# EAGLE schematic Main Board (EAGLE 9.3.2)
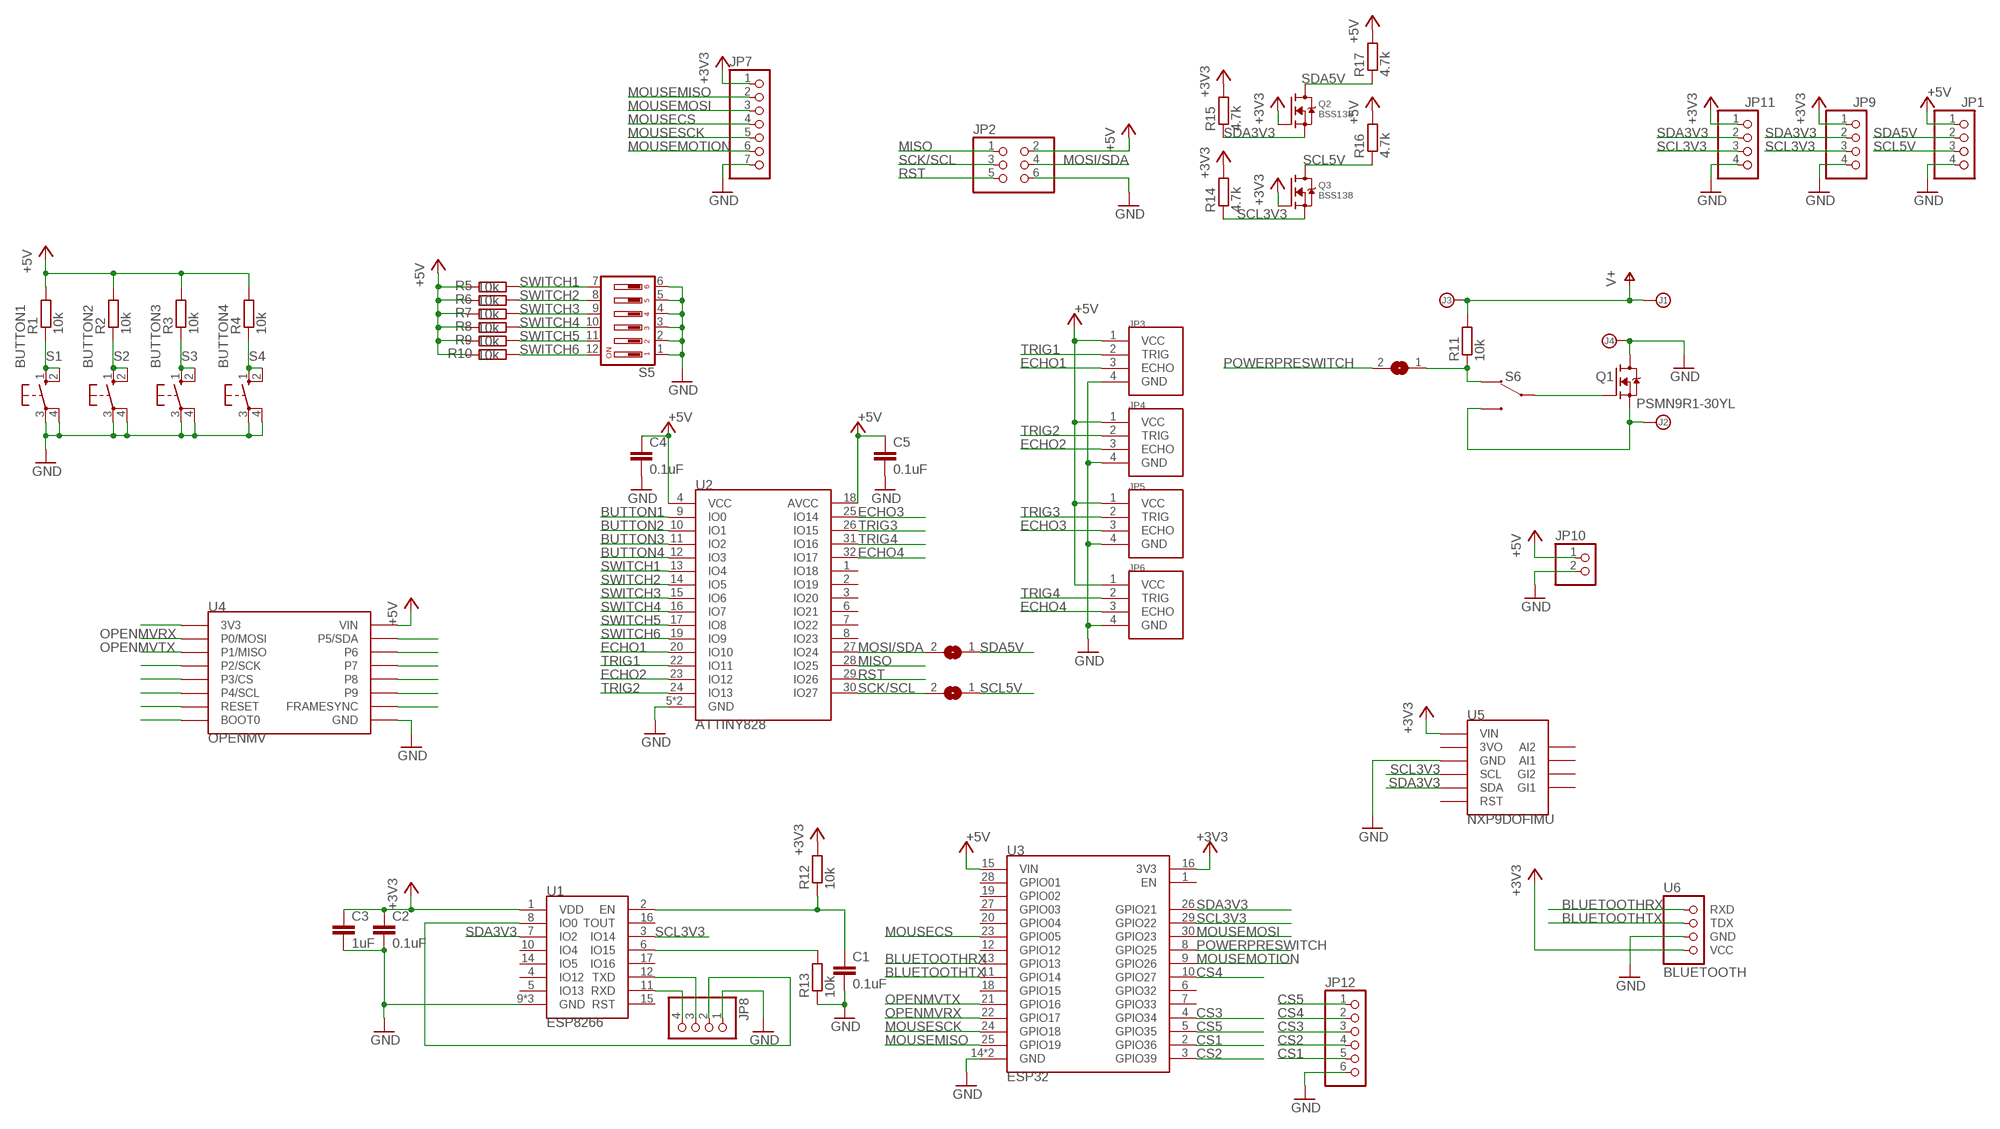
[diagram p0: schematic, sheet 1]

## Parts
C1  0.1uF  C-EUC0805  [C0805]
C2  0.1uF  C-EUC0805  [C0805]
C3  1uF  C-EUC0805  [C0805]
C4  0.1uF  C-EUC0805  [C0805]
C5  0.1uF  C-EUC0805  [C0805]
J1  MOLEXQUICKCONNECT  [MOLEXQUICKCONNECT]
J2  MOLEXQUICKCONNECT  [MOLEXQUICKCONNECT]
J3  MOLEXQUICKCONNECT  [MOLEXQUICKCONNECT]
J4  MOLEXQUICKCONNECT  [MOLEXQUICKCONNECT]
JP1  PINHD-1X4  [1X04]
JP2  PINHD-2X3  [2X03]
JP3  HC-SR04  [HC-SR04]
JP4  HC-SR04  [HC-SR04]
JP5  HC-SR04  [HC-SR04]
JP6  HC-SR04  [HC-SR04]
JP7  PINHD-1X7  [1X07]
JP8  PINHD-1X4  [1X04]
JP9  PINHD-1X4  [1X04]
JP10  PINHD-1X2  [1X02]
JP11  PINHD-1X4  [1X04]
JP12  PINHD-1X6  [1X06]
Q1  PSMN9R1-30YL  [LFPAK]
Q2  BSS138  [SOT95P240X120-3N]
Q3  BSS138  [SOT95P240X120-3N]
R1  10k  R-EU_R0805  [R0805]
R2  10k  R-EU_R0805  [R0805]
R3  10k  R-EU_R0805  [R0805]
R4  10k  R-EU_R0805  [R0805]
R5  10k  R-EU_R0805  [R0805]
R6  10k  R-EU_R0805  [R0805]
R7  10k  R-EU_R0805  [R0805]
R8  10k  R-EU_R0805  [R0805]
R9  10k  R-EU_R0805  [R0805]
R10  10k  R-EU_R0805  [R0805]
R11  10k  R-EU_R0805  [R0805]
R12  10k  R-EU_R0805  [R0805]
R13  10k  R-EU_R0805  [R0805]
R14  4.7k  R-EU_R0805  [R0805]
R15  4.7k  R-EU_R0805  [R0805]
R16  4.7k  R-EU_R0805  [R0805]
R17  4.7k  R-EU_R0805  [R0805]
S1  BUTTON  [BUTTON]
S2  BUTTON  [BUTTON]
S3  BUTTON  [BUTTON]
S4  BUTTON  [BUTTON]
S5  SWITCHARRAY6  [SWITCHARRAY6]
S6  SS-12D07-VG  [SS-12D07-VG]
SJ1  SJ  [SJ]
SJ2  SJ  [SJ]
SJ3  SJ  [SJ]
U1  ESP8266  [ESP8266]
U2  ATTINY828  [QFP80P900X900X120-32]
U3  ESP32  [ESP32]
U4  OPENMV  [OPENMV]
U5  NXP9DOFIMU  [NXP9DOFIMU]
U6  BLUETOOTH  [BLUETOOTH]

## Nets
+3V3: C2.1 C3.1 JP7.1 JP9.1 JP11.1 Q2.1(G) Q3.1(G) R12.2 R14.2 R15.2 U1.1(VDD) U3.16(3V3) U5.VIN U6.VCC
+5V: C4.1 C5.1 JP1.1 JP2.2 JP3.1(VCC) JP4.1(VCC) JP5.1(VCC) JP6.1(VCC) JP10.1 R1.2 R2.2 R3.2 R4.2 R5.2 R6.2 R7.2 R8.2 R9.2 R10.2 R16.2 R17.2 U2.4(VCC) U2.18(AVCC) U3.15(VIN) U4.15(VIN) U4.15ALT(VIN) U4.P$15(VIN)
BLUETOOTHRX: U3.13(GPIO13) U6.RXD
BLUETOOTHTX: U3.11(GPIO14) U6.TXD(TDX)
BUTTON1: R1.1 S1.1(S) S1.2(S1) U2.9(IO0)
BUTTON2: R2.1 S2.1(S) S2.2(S1) U2.10(IO1)
BUTTON3: R3.1 S3.1(S) S3.2(S1) U2.11(IO2)
BUTTON4: R4.1 S4.1(S) S4.2(S1) U2.12(IO3)
CS1: JP12.5 U3.2(GPIO36)
CS2: JP12.4 U3.3(GPIO39)
CS3: JP12.3 U3.4(GPIO34)
CS4: JP12.2 U3.10(GPIO27)
CS5: JP12.1 U3.5(GPIO35)
ECHO1: JP3.3(ECHO) U2.20(IO10)
ECHO2: JP4.3(ECHO) U2.23(IO12)
ECHO3: JP5.3(ECHO) U2.25(IO14)
ECHO4: JP6.3(ECHO) U2.32(IO17)
GND: C1.2 C2.2 C3.2 C4.2 C5.2 J4.P$1 J4.P$3 J4.P$4 JP1.4 JP2.6 JP3.4(GND) JP4.4(GND) JP5.4(GND) JP6.4(GND) JP7.7 JP8.1 JP9.4 JP10.2 JP11.4 JP12.6 Q1.TAB(D) R13.1 S1.3(P) S1.4(P1) S2.3(P) S2.4(P1) S3.3(P) S3.4(P1) S4.3(P) S4.4(P1) S5.1 S5.2 S5.3 S5.4 S5.5 S5.6 U1.9(GND) U1.13(GND) U1.18(GND) U2.5(GND) U2.21(GND) U3.14(GND) U3.17(GND) U4.16(GND) U4.16ALT(GND) U4.P$16(GND) U5.GND U6.GND
MISO: JP2.1 U2.28(IO25)
MOSI/SDA: JP2.4 SJ2.2 U2.27(IO24)
MOUSECS: JP7.4 U3.23(GPIO05)
MOUSEMISO: JP7.2 U3.25(GPIO19)
MOUSEMOSI: JP7.3 U3.30(GPIO23)
MOUSEMOTION: JP7.6 U3.9(GPIO26)
MOUSESCK: JP7.5 U3.24(GPIO18)
N$1: C1.1 R12.1 U1.2(EN)
N$2: JP8.4 U1.11(RXD)
N$3: JP8.3 U1.12(TXD)
N$4: R13.2 U1.6(IO15)
N$5: J2.P$1 J2.P$3 J2.P$4 Q1.1(S) Q1.2(S) Q1.3(S) S6.2
N$6: JP8.2 U1.8(IO0)
N$7: Q1.4(G) S6.COM
N$8: U4.10(BOOT0) U4.10ALT(BOOT0) U4.P$10(BOOT0)
N$9: U4.9(RESET) U4.9ALT(RESET) U4.P$9(RESET)
N$10: U4.5(P4/SCL) U4.5ALT(P4/SCL) U4.P$5(P4/SCL)
N$11: U4.4(P3/CS) U4.4ALT(P3/CS) U4.P$4(P3/CS)
N$12: U4.3(P2/SCK) U4.3ALT(P2/SCK) U4.P$3(P2/SCK)
N$13: R11.1 S6.1 SJ1.1
N$14: U4.8(3V3) U4.8ALT(3V3) U4.P$8(3V3)
N$16: U4.11(FRAMESYNC) U4.11ALT(FRAMESYNC) U4.P$11(FRAMESYNC)
N$17: U4.12(P9) U4.12ALT(P9) U4.P$12(P9)
N$18: U4.13(P8) U4.13ALT(P8) U4.P$13(P8)
N$19: U4.14(P7) U4.14ALT(P7) U4.P$14(P7)
N$20: U4.7(P6) U4.7ALT(P6) U4.P$7(P6)
N$21: U4.6(P5/SDA) U4.6ALT(P5/SDA) U4.P$6(P5/SDA)
OPENMVRX: U3.22(GPIO17) U4.1(P0/MOSI) U4.1ALT(P0/MOSI) U4.P$1(P0/MOSI)
OPENMVTX: U3.21(GPIO16) U4.2(P1/MISO) U4.2ALT(P1/MISO) U4.P$2(P1/MISO)
POWERPRESWITCH: SJ1.2 U3.8(GPIO25)
RST: JP2.5 U2.29(IO26)
SCK/SCL: JP2.3 SJ3.2 U2.30(IO27)
SCL3V3: JP9.3 JP11.3 Q3.2(S) R14.1 U1.3(IO14) U3.29(GPIO22) U5.SCL
SCL5V: JP1.3 Q3.3(D) R16.1 SJ3.1
SDA3V3: JP9.2 JP11.2 Q2.2(S) R15.1 U1.7(IO2) U3.26(GPIO21) U5.SDA
SDA5V: JP1.2 Q2.3(D) R17.1 SJ2.1
SWITCH1: R5.1 S5.7 U2.13(IO4)
SWITCH2: R6.1 S5.8 U2.14(IO5)
SWITCH3: R7.1 S5.9 U2.15(IO6)
SWITCH4: R8.1 S5.10 U2.16(IO7)
SWITCH5: R9.1 S5.11 U2.17(IO8)
SWITCH6: R10.1 S5.12 U2.19(IO9)
TRIG1: JP3.2(TRIG) U2.22(IO11)
TRIG2: JP4.2(TRIG) U2.24(IO13)
TRIG3: JP5.2(TRIG) U2.26(IO15)
TRIG4: JP6.2(TRIG) U2.31(IO16)
V+: J1.P$1 J1.P$3 J1.P$4 J3.P$1 J3.P$3 J3.P$4 R11.2
Unconnected: U1.4(IO12) U1.5(IO13) U1.10(IO4) U1.14(IO5) U1.15(RST) U1.16(TOUT) U1.17(IO16) U2.1(IO18) U2.2(IO19) U2.3(IO20) U2.6(IO21) U2.7(IO22) U2.8(IO23) U3.1(EN) U3.6(GPIO32) U3.7(GPIO33) U3.12(GPIO12) U3.18(GPIO15) U3.19(GPIO02) U3.20(GPIO04) U3.27(GPIO03) U3.28(GPIO01) U5.AI1 U5.AI2 U5.GI1 U5.GI2 U5.RST

## Power pins joined to a net without a drawn wire
3VO: U5.3VO

## Library data of the parts
C1-C5 = rcl:C-EU: CAPACITOR, European symbol; SPICEPREFIX: C
J1-J4 = Robocup:MOLEXQUICKCONNECT
JP1 JP8 JP9 JP11 = pinhead:PINHD-1X4: PIN HEADER
JP2 = pinhead:PINHD-2X3: PIN HEADER
JP3-JP6 = Robocup:HC-SR04
JP7 = pinhead:PINHD-1X7: PIN HEADER
JP10 = pinhead:PINHD-1X2: PIN HEADER
JP12 = pinhead:PINHD-1X6: PIN HEADER
Q1 = Robocup2019:PSMN9R1-30YL
Q2 Q3 = Robocup:BSS138: MOSFET N-Channel 50V 0.22A SOT23 Fairchild BSS138 N-channel MOSFET Transistor, 0.22 A, 50 V, 3-Pin SOT-23 Source: Datasheet <http://docs-europe.electrocomponents.com/webdocs/0d22/0900766b80d22ec5.pdf>; ARROW_PART_NUMBER: BSS138; ARROW_PRICE/STOCK: http://uk.rs-online.com/web/p/products/1241694; DESCRIPTION: MOSFET N-Channel 50V 0.22A SOT23 Fairchild BSS138 N-channel MOSFET Transistor, 0.22 A, 50 V, 3-Pin SOT-23; HEIGHT: 1.2mm; MANUFACTURER_NAME: Fairchild Semiconductor; MANUFACTURER_PART_NUMBER: BSS138; RS_PART_NUMBER: 1241694; RS_PRICE/STOCK: http://uk.rs-online.com/web/p/products/1241694
R1-R17 = rcl:R-EU_: RESISTOR, European symbol; SPICEPREFIX: R
S1-S4 = Robocup2019:BUTTON: OMRON SWITCH; MPN: B3F-1000; OC_FARNELL: 176432; OC_NEWARK: 36M3542
S5 = Robocup2019:SWITCHARRAY6: DIL/CODE SWITCH; OC_FARNELL: unknown; OC_NEWARK: unknown
S6 = Robocup2019:SS-12D07-VG
SJ1-SJ3 = jumper:SJ: SMD solder JUMPER
U1 = Robocup2019:ESP8266
U2 = Robocup2019:ATTINY828
U3 = Robocup2019:ESP32
U4 = Robocup2019:OPENMV
U5 = Robocup2019:NXP9DOFIMU
U6 = Robocup2019:BLUETOOTH

## Net classes
0 default: width 0.203 mm